# EAGLE design uni_node_02 (EAGLE 9.6.2)

## Sheet 1 of 2
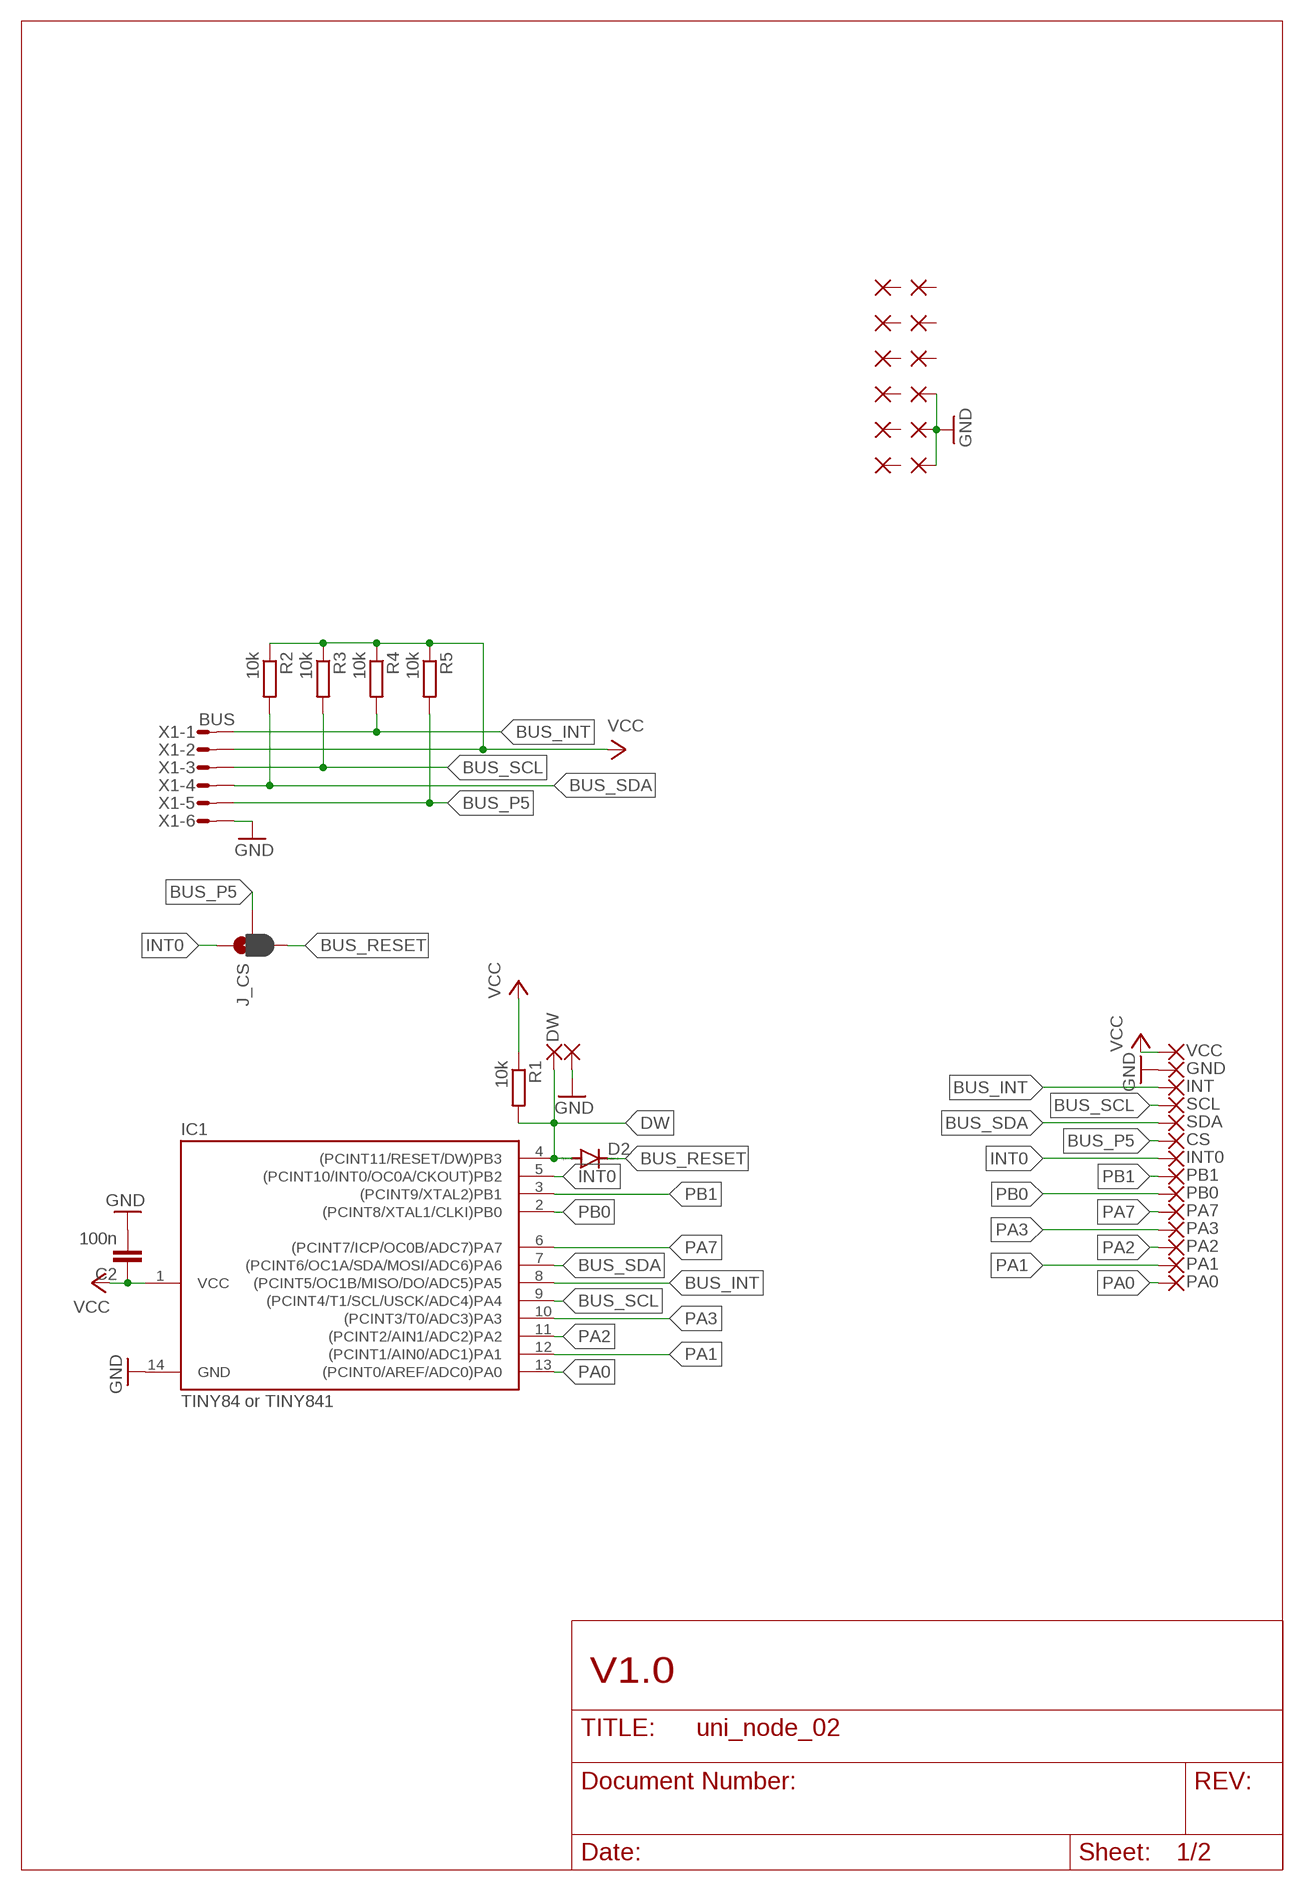
[diagram p0: schematic, sheet 1]

### Parts
C2  100n  C-EUC0805  [C0805]
CS  1,6/0,9  [1,6/0,9]
D2  DIODE-MINIMELF  [MINIMELF]
DW  1,6/0,9  [1,6/0,9]
GND  1,6/0,9  [1,6/0,9]
GND_  1,6/0,9  [1,6/0,9]
IC1  TINY84 or TINY841  TINY24/44/84-SSU  [SOIC14]
INT  1,6/0,9  [1,6/0,9]
INT0  1,6/0,9  [1,6/0,9]
J_CS  JUMPER-SMT_3_1-NC_PASTE_NO-SILK  [SMT-JUMPER_3_1-NC_PASTE_NO-SILK]
PA0  1,6/0,9  [1,6/0,9]
PA1  1,6/0,9  [1,6/0,9]
PA2  1,6/0,9  [1,6/0,9]
PA3  1,6/0,9  [1,6/0,9]
PA7  1,6/0,9  [1,6/0,9]
PAD89  1,6/0,9  [1,6/0,9]
PAD90  1,6/0,9  [1,6/0,9]
PAD91  1,6/0,9  [1,6/0,9]
PAD94  1,6/0,9  [1,6/0,9]
PAD95  1,6/0,9  [1,6/0,9]
PAD96  1,6/0,9  [1,6/0,9]
PAD97  1,6/0,9  [1,6/0,9]
PAD98  1,6/0,9  [1,6/0,9]
PAD99  1,6/0,9  [1,6/0,9]
PAD100  1,6/0,9  [1,6/0,9]
PAD101  1,6/0,9  [1,6/0,9]
PAD102  1,6/0,9  [1,6/0,9]
PB0  1,6/0,9  [1,6/0,9]
PB1  1,6/0,9  [1,6/0,9]
R1  10k  R-EU_M0805  [M0805]
R2  10k  R-EU_M0805  [M0805]
R3  10k  R-EU_M0805  [M0805]
R4  10k  R-EU_M0805  [M0805]
R5  10k  R-EU_M0805  [M0805]
SCL  1,6/0,9  [1,6/0,9]
SDA  1,6/0,9  [1,6/0,9]
VCC  1,6/0,9  [1,6/0,9]
X1  BUS  MICROMATCH-6  [MICROMATCH-6]

### Nets
BUS_INT: IC1.8((PCINT5/OC1B/MISO/DO/ADC5)PA5) INT.1(P) R4.2 X1.1
BUS_P5: CS.1(P) J_CS.2 R5.2 X1.5
BUS_RESET: D2.C J_CS.3
BUS_SCL: IC1.9((PCINT4/T1/SCL/USCK/ADC4)PA4) R3.2 SCL.1(P) X1.3
BUS_SDA: IC1.7((PCINT6/OC1A/SDA/MOSI/ADC6)PA6) R2.2 SDA.1(P) X1.4
DW: D2.A DW.1(P) IC1.4((PCINT11/RESET/DW)PB3) R1.2
GND: C2.2 GND.1(P) GND_.1(P) IC1.14(GND) PAD100.1(P) PAD101.1(P) PAD102.1(P) X1.6
INT0: IC1.5((PCINT10/INT0/OC0A/CKOUT)PB2) INT0.1(P) J_CS.1
PA0: IC1.13((PCINT0/AREF/ADC0)PA0) PA0.1(P)
PA1: IC1.12((PCINT1/AIN0/ADC1)PA1) PA1.1(P)
PA2: IC1.11((PCINT2/AIN1/ADC2)PA2) PA2.1(P)
PA3: IC1.10((PCINT3/T0/ADC3)PA3) PA3.1(P)
PA7: IC1.6((PCINT7/ICP/OC0B/ADC7)PA7) PA7.1(P)
PB0: IC1.2((PCINT8/XTAL1/CLKI)PB0) PB0.1(P)
PB1: IC1.3((PCINT9/XTAL2)PB1) PB1.1(P)
VCC: C2.1 IC1.1(VCC) R1.1 R2.1 R3.1 R4.1 R5.1 VCC.1(P) X1.2
Unconnected: PAD89.1(P) PAD90.1(P) PAD91.1(P) PAD94.1(P) PAD95.1(P) PAD96.1(P) PAD97.1(P) PAD98.1(P) PAD99.1(P)

### Notes on the sheet
- V1.0

## Sheet 2 of 2

## Library data of the parts
C2 = rcl:C-EU: CAPACITOR, European symbol
CS DW GND GND_ INT INT0 PA0 PA1-PA3 PA7 PAD89-PAD91 PAD94-PAD102 PB0 PB1 SCL SDA VCC = wirepad:1,6/0,9: THROUGH-HOLE PAD
D2 = diode:DIODE-: DIODE
IC1 = avr-7:TINY24/44/84
J_CS = SparkFun-Jumpers:JUMPER-SMT_3_1-NC_PASTE: Normally closed solder jumper (1 of 2 connections) This jumper has an aperture in the stencil to allow solder paste to bridge one of the two connections. One connection is normally closed (NC), while the other is normally open (NO). Wick off the solder to open the connection. Reapply solder to reclose the connection. Apply solder to the other side instead to change the current path.
R1-R5 = rcl:R-EU_: RESISTOR, European symbol; SPICEPREFIX: R
X1 = con-amp-micromatch:MICROMATCH-6: MicroMaTch 6 7-215464-6 / 0-215464-6 Drawing Number C-215464 DDEController.pdf; MPN: 7-215464-6; OC_FARNELL: 3784630; OC_NEWARK: 19R8125

## Net classes
1 gnd: width 0.381 mm, drill 0.381 mm
2 power: width 0.762 mm, drill 0.762 mm

## Board
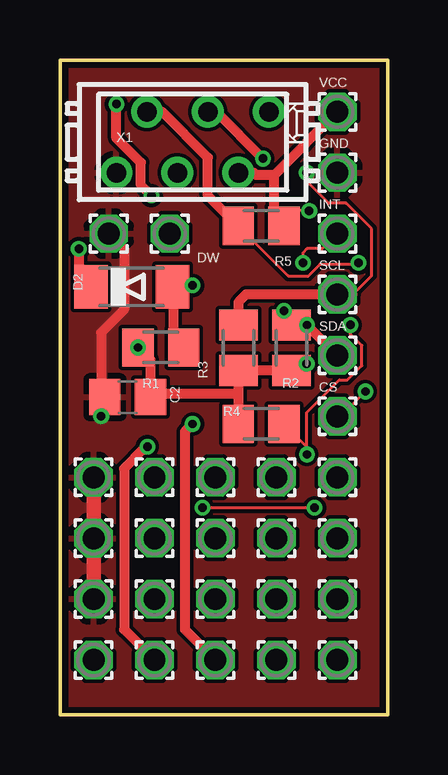
[diagram p1: board, top side]
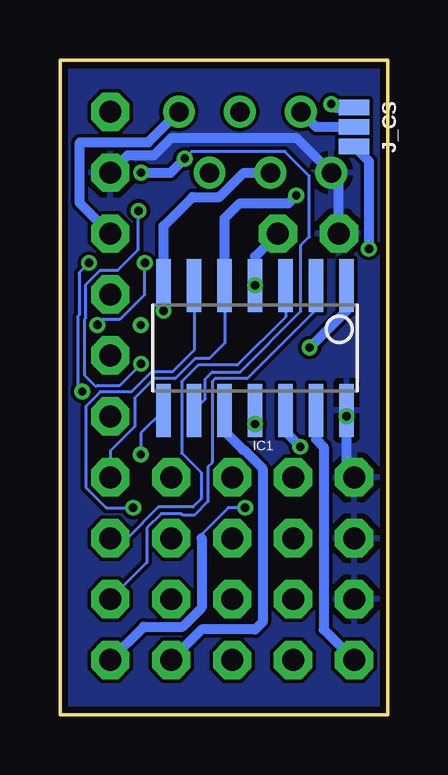
[diagram p2: board, bottom side, seen from below]

Size 13.65 x 27.3 mm. Coordinates in mm from the lower left corner, seen from the top.
Outline: 0,0 13.65,0 13.65,27.3 0,27.3 0,0
Copper layers (1*16): Top 0.035mm / dielectric 1.5mm / Bottom 0.035mm
Design rules "eagle": minimum track width 5mil, minimum drill 12mil, track to track 6mil, track to pad 6mil, pad to pad 6mil, via to via 6mil, smd to smd 0mil, copper to edge 10mil, drill to drill 10mil, minimum pad ring 10mil, minimum via ring 6mil, stop-mask expansion 2mil, vias tented up to drill 25mil, thermal gap 10mil

### Footprints (pad centres in the part's own frame; a part is rotated, then mirrored left to right if it is on the bottom)
C0805 = smd 1.3 x 1.5: 1 -0.95,0; 2 0.95,0
1,6/0,9 = drill 0.914 pad 1.6 octagon: 1 0,0
MINIMELF = smd 1.4 x 1.8: A 1.7,0; C -1.7,0
SOIC14 = smd 0.61 x 2.21: 1 -3.81,-2.603; 2 -2.54,-2.603; 3 -1.27,-2.603; 4 0,-2.603; 5 1.27,-2.603; 6 2.54,-2.603; 7 3.81,-2.603; 8 3.81,2.603; 9 2.54,2.603; 10 1.27,2.603; 11 0,2.603; 12 -1.27,2.603; 13 -2.54,2.603; 14 -3.81,2.603
SMT-JUMPER_3_1-NC_PASTE_NO-SILK = smd 0.635 x 1.27: 1 -0.813,0; 2 0,0; 3 0.813,0
M0805 = smd 1.3 x 1.6: 1 -0.95,0; 2 0.95,0
MICROMATCH-6 = drill 0.813: 1 3.175,1.27; 2 1.905,-1.27; 3 0.635,1.27; 4 -0.635,-1.27; 5 -1.905,1.27; 6 -3.175,-1.27

### Placement (x,y rotation side)
C2  2.82,13.25 180 top
CS  11.56,12.45 0 top
D2  2.98,17.84 0 top
DW  4.57,20.07 0 top
GND  11.56,22.61 0 top
GND_  2.03,20.07 0 top
IC1  5.52,15.3 180 bottom
INT  11.56,20.07 0 top
INT0  11.56,9.91 0 top
J_CS  1.4,24.51 270 bottom
PA0  1.4,2.29 0 top
PA1  3.94,2.29 0 top
PA2  6.48,2.29 0 top
PA3  9.02,2.29 0 top
PA7  11.56,2.29 0 top
PAD89  9.02,7.37 0 top
PAD90  6.48,7.37 0 top
PAD91  6.48,4.83 0 top
PAD94  6.48,9.91 0 top
PAD95  3.94,7.37 0 top
PAD96  3.94,4.83 0 top
PAD97  9.02,9.91 0 top
PAD98  9.02,4.83 0 top
PAD99  3.94,9.91 0 top
PAD100  1.4,9.91 0 top
PAD101  1.4,7.37 0 top
PAD102  1.4,4.83 0 top
PB0  11.56,4.83 0 top
PB1  11.56,7.37 0 top
R1  4.2,15.32 0 top
R2  9.65,15.3 90 top
R3  7.43,15.3 90 top
R4  8.38,12.13 0 top
R5  8.38,20.38 180 top
SCL  11.56,17.53 0 top
SDA  11.56,14.99 0 top
VCC  11.56,25.15 0 top
X1  5.52,23.88 0 top

### Tracks (layer width: path | path; a pad name or v marks a point on that pad's centre or on a via)
BUS_INT  (via drill 0.35)
  Top 0.127: v12.1,16.26 12.1,15.88 12.57,15.41 12.57,14.56 11.98,13.97 11.64,13.97 10.29,12.61 v10.29,10.86 10.29,11.17 R4.2 | INT.1 10.92,19.43 10.29,19.43 10.12,19.26 v10.12,18.84
  Bottom 0.127: IC1.8 10.29,11.75 v10.29,10.86 | v12.1,16.26 11.84,16.51 11.14,16.51 10.12,17.53 v10.12,18.84
  Bottom 0.406: INT.1 12.83,21.34 12.83,23.88 9.97,23.88 X1.1
BUS_P5  (via drill 0.35)
  Top 0.127: R5.2 9.52,18.3 10.34,18.3 10.84,18.8 12.39,18.8 v12.44,18.85 | v12.73,13.48 11.69,12.45 CS.1
  Top 0.406: R5.2 6.16,21.66 6.16,23.24 4.25,25.15 X1.5
  Bottom 0.127: v12.44,18.85 12.85,18.44 12.85,16.66 12.92,16.6 12.92,13.68 v12.73,13.48
  Bottom 0.406: J_CS.2 2.98,24.51 X1.5
BUS_RESET  (via drill 0.35)
  Top 0.406: v0.79,19.43 0.79,18.34 D2.C
  Bottom 0.406: J_CS.3 0.79,23.09 v0.79,19.43
BUS_SCL  (via drill 0.35)
  Top 0.127: 12.19,17.53 12.99,18.32 12.99,20.27 11.92,21.34 11.19,21.34 10.4,22.13 10.4,22.48
  Top 0.406: 12.19,17.53 SCL.1 7.75,17.53 7.43,17.21 R3.2 | 10.4,22.48 v10.28,22.61 | v8.46,23.19 6.5,25.15 X1.3
  Bottom 0.127: IC1.9 7.59,13.17 7.59,14.01 7.3,14.3 6.15,14.3 3.62,16.83 3.62,19.58 3.26,19.94 3.26,22.47 4.28,23.48 8.17,23.48 v8.46,23.19
  Bottom 0.406: v10.28,22.61 9.04,22.61 v8.46,23.19
BUS_SDA  (via drill 0.35)
  Top 0.127: v10.29,16.25 R2.2 9.34,16.57 v9.34,16.84
  Top 0.406: v10.29,16.25 SDA.1
  Bottom 0.127: IC1.7 v9.34,16.84
  Bottom 0.406: IC1.7 9.34,20.38 8.13,21.59 7.01,21.59 5.99,22.61 X1.4
DW  (via drill 0.35)
  Top 0.406: D2.A 4.75,17.91 | 4.75,17.91 IC1.4 | R1.2 4.75,15.72 4.75,17.91
  Bottom 0.406: DW.1 5.52,19.11 IC1.4
  other vias: 5.52,17.91
GND  (via drill 0.35)
  Top 0.127: v1.71,12.45 1.71,12.76 1.87,12.92 C2.2
  Top 0.406: GND_.1 2.67,19.43 2.67,16.89 1.71,15.94 1.71,13.4 C2.2
  Top 0.61: PAD100.1 PAD101.1 PAD102.1
  Bottom 0.406: IC1.14 v1.71,12.45 1.71,10.22 | GND.1 10.85,23.32 9.74,23.32 9.02,24.04 3.78,24.04 X1.6 2.03,22.29 GND_.1
  Bottom 0.61: PAD100.1 1.71,10.22
  pour Bottom: 0,0 13.65,0 13.65,27.3 0,27.3
  pour Top: 0,0 13.65,0 13.65,27.3 0,27.3
INT0  (via drill 0.35)
  Top 0.406: v3.81,21.65 3.37,22.09 3.37,23.03 2.35,24.04 v2.35,25.46
  Bottom 0.127: IC1.5 6.79,15.49 7.43,14.86 8.02,14.86 8.85,14.02 9.73,14.02 10.54,13.21 10.54,12.03 11.56,11.01 INT0.1
  Bottom 0.406: IC1.5 6.79,20.7 6.16,21.34 4.12,21.34 v3.81,21.65 | v2.35,25.46 2.21,25.32 J_CS.1
PA0
  Bottom 0.406: IC1.13 2.98,11.49 2.67,11.18 2.67,3.56 PA0.1
PA1  (via drill 0.35)
  Top 0.406: v3.64,11.19 3.52,11.06 3.46,11.06 2.67,10.27 2.67,3.56 PA1.1
  Bottom 0.406: IC1.12 4.25,11.8 v3.64,11.19
PA2  (via drill 0.35)
  Top 0.406: v5.52,12.13 5.21,11.81 5.21,3.56 PA2.1
  Bottom 0.406: IC1.11 v5.52,12.13
PA3
  Bottom 0.406: IC1.10 6.79,11.81 6.04,11.06 6,11.06 5.21,10.27 5.21,3.87 5.52,3.56 7.75,3.56 PA3.1
PA7  (via drill 0.35)
  Top 0.127: v10.6,8.64 v5.94,8.64
  Bottom 0.127: IC1.6 8.06,15.21 8.97,14.3 9.84,14.3 10.68,13.46 11.98,13.46 12.57,12.87 12.57,9.48 11.72,8.64 v10.6,8.64 | 7.75,7.37 7.75,7.53 6.64,8.64 v5.94,8.64
  Bottom 0.406: PA7.1 10.17,3.67 8.54,3.67 7.75,4.46 7.75,7.37
PB0
  Bottom 0.127: IC1.2 2.98,16.89 5.86,14.02 7.19,14.02 7.32,13.89 7.32,10.51 7.49,10.33 7.49,8.89 8.06,8.32 8.53,8.32 8.6,8.38 9.44,8.38 10.03,7.79 10.03,6.35 PB0.1
PB1
  Bottom 0.127: IC1.3 4.25,16.59 6.26,14.58 7.9,14.58 8.59,13.89 8.59,10.91 7.77,10.1 7.77,9.01 8.12,8.66 9.55,8.66 10.85,7.37 PB1.1
VCC  (via drill 0.35)
  Top 0.127: R5.1 9.97,21.02 v10.38,21.02 | v10.28,14.64 9.99,14.35 R2.1
  Top 0.406: X1.2 8.08,22.61 8.17,22.51 8.92,22.51 | VCC.1 8.92,22.51 | R5.1 8.92,20.79 8.92,22.51 | R1.1 3.77,14.8 C2.1 3.92,13.4 7.43,13.4 | R2.1 R3.1 7.43,13.4 | 7.43,13.4 R4.1
  Bottom 0.127: v10.28,14.64 11.17,13.74 12.09,13.74 12.12,13.72 12.19,13.72 12.64,14.16 12.64,16.48 12.57,16.55 12.57,17.95 11.98,18.54 11.24,18.54 10.38,19.4 v10.38,21.02
  Bottom 0.406: IC1.1 1.71,16.86 R1.1
  other vias: 3.25,15.32

### Text on the board
_tNames: VCC | X1 | GND | INT | DW | R5 | SCL | D2 | SDA | R1 | R3 | R2 | C2 | CS | R4
_bNames: J_CS | IC1